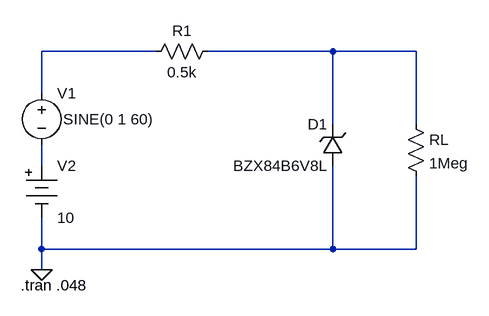
[diagram p0: schematic Diodo - Diodo_Pequenos_Sinais_Exemplo 3.asc]
Diodo - Diodo_Pequenos_Sinais_Exemplo 3.asc, the LTspice schematic file:
Version 4
SHEET 1 1404 680
WIRE 208 112 32 112
WIRE 480 112 288 112
WIRE 608 112 480 112
WIRE 32 176 32 112
WIRE 480 224 480 112
WIRE 608 224 608 112
WIRE 32 288 32 256
WIRE 32 416 32 368
WIRE 480 416 480 288
WIRE 480 416 32 416
WIRE 608 416 608 304
WIRE 608 416 480 416
WIRE 32 448 32 416
FLAG 32 448 0
SYMBOL voltage 32 160 R0
WINDOW 3 33 56 Left 2
WINDOW 123 0 0 Left 2
WINDOW 39 0 0 Left 2
SYMATTR Value SINE(0 1 60)
SYMATTR InstName V1
SYMBOL Misc\\battery 32 272 R0
SYMATTR InstName V2
SYMATTR Value 10
SYMATTR SpiceLine Rser=0
SYMBOL res 192 128 R270
WINDOW 0 32 56 VTop 2
WINDOW 3 0 56 VBottom 2
SYMATTR InstName R1
SYMATTR Value 0.5k
SYMBOL zener 496 288 R180
WINDOW 0 24 64 Left 2
WINDOW 3 24 0 Left 2
SYMATTR InstName D1
SYMATTR Value BZX84B6V8L
SYMATTR Description Diode
SYMATTR Type diode
SYMBOL res 592 208 R0
SYMATTR InstName RL
SYMATTR Value 1Meg
TEXT 0 472 Left 2 !.tran .048

The netlist it stands for:
* Diodo - Diodo_Pequenos_Sinais_Exemplo 3.asc
V1 N001 N003 SINE(0 1 60)
V2 N003 0 10 Rser=0
R1 N001 N002 0.5k
D1 0 N002 BZX84B6V8L
RL N002 0 1Meg
.model D D
.lib standard.dio
.tran .048
.backanno
.end